# Altium schematic sheet GSR.SchDoc
size A; SheetNumber: 2; SheetTotal: 3
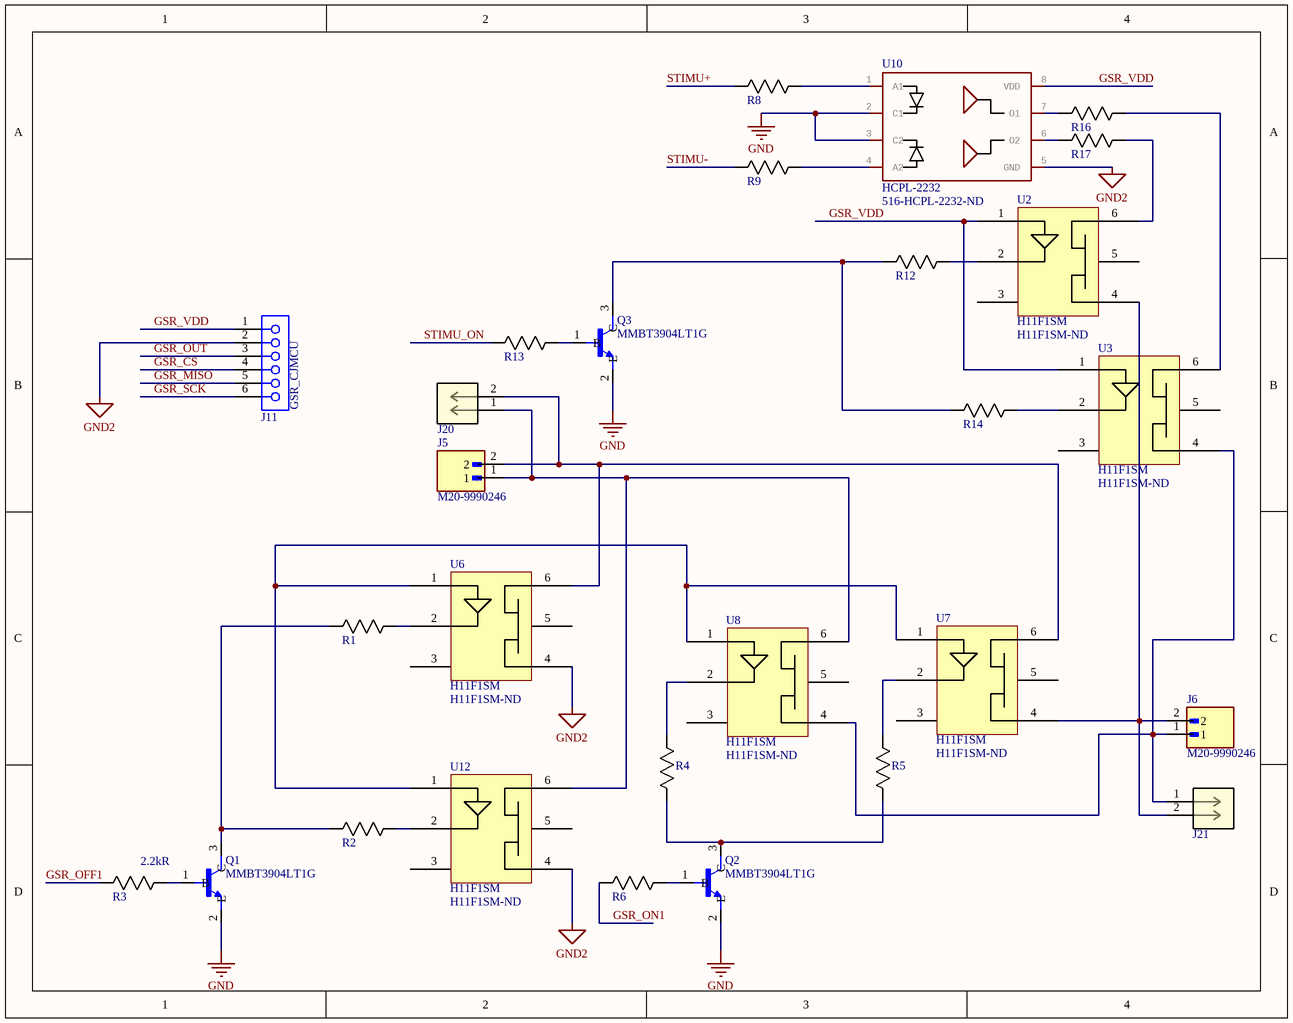
[diagram p0: GSR.SchDoc]

## Parts
J5  M20-9990246  [HARWIN_M20-9990246]
J6  M20-9990246  [HARWIN_M20-9990246]
J11  61300611821  [HEADER_SOCKET_6]  (value not drawn)
J20  B2P-VH  [CONN_B2P-VH_JST]  (value not drawn)
J21  B2P-VH  [CONN_B2P-VH_JST]  (value not drawn)
Q1  MMBT3904LT1G  [SOT95P240X111-3N]
Q2  MMBT3904LT1G  [SOT95P240X111-3N]
Q3  MMBT3904LT1G  [SOT95P240X111-3N]
R1  RMCF1206FT220R  [STA_RMCF1206_STP-L]  (value not drawn)
R2  RMCF1206FT220R  [STA_RMCF1206_STP-L]  (value not drawn)
R3  Resistance: 2.2kR  [STA_RMCF1206_STP-L]  (hidden comment: CRGCQ1206F2K2)
R4  RMCF1206FT220R  [STA_RMCF1206_STP-L]  (value not drawn)
R5  RMCF1206FT220R  [STA_RMCF1206_STP-L]  (value not drawn)
R6  CRGCQ1206F2K2  [STA_RMCF1206_STP-L]  (value not drawn)
R8  RMCF1206FT220R  [STA_RMCF1206_STP-L]  (value not drawn)
R9  RMCF1206FT220R  [STA_RMCF1206_STP-L]  (value not drawn)
R12  RMCF1206FT220R  [STA_RMCF1206_STP-L]  (value not drawn)
R13  CRGCQ1206F2K2  [STA_RMCF1206_STP-L]  (value not drawn)
R14  RMCF1206FT220R  [STA_RMCF1206_STP-L]  (value not drawn)
R16  CRGCQ1206F2K2  [STA_RMCF1206_STP-L]  (value not drawn)
R17  CRGCQ1206F2K2  [STA_RMCF1206_STP-L]  (value not drawn)
U2  H11F1SM  Supplier Part Number 1: H11F1SM-ND  [OPTOCOUPLER_H11F3SR2M]
U3  H11F1SM  Supplier Part Number 1: H11F1SM-ND  [OPTOCOUPLER_H11F3SR2M]
U6  H11F1SM  Supplier Part Number 1: H11F1SM-ND  [OPTOCOUPLER_H11F3SR2M]
U7  H11F1SM  Supplier Part Number 1: H11F1SM-ND  [OPTOCOUPLER_H11F3SR2M]
U8  H11F1SM  Supplier Part Number 1: H11F1SM-ND  [OPTOCOUPLER_H11F3SR2M]
U10  HCPL-2232  Supplier Part Number 1: 516-HCPL-2232-ND  [DIL08]
U12  H11F1SM  Supplier Part Number 1: H11F1SM-ND  [OPTOCOUPLER_H11F3SR2M]

## Nets
GND: Q1.2(E) Q2.2(E) Q3.2(E) U10.2(C1) U10.3(C2)
GND2: J11.2 U6.4 U10.5(GND) U12.4
GSR_CS: J11.4
GSR_MISO: J11.5
GSR_OFF1: R3.1
GSR_ON1: R6.1
GSR_OUT: J11.3
GSR_SCK: J11.6
GSR_VDD: J11.1 U2.1 U3.1 U10.8(VDD)
STIMU+: R8.1
STIMU-: R9.1
STIMU_ON: R13.1
NetJ5_1: J5.1 J20.1 U8.6 U12.6
NetJ5_2: J5.2 J20.2 U6.6 U7.6
NetJ6_1: J6.1 J21.1 U3.4 U8.4
NetJ6_2: J6.2 J21.2 U2.4 U7.4
NetQ1_1: Q1.1(B) R3.2
NetQ1_3: Q1.3(C) R1.1 R2.1
NetQ2_1: Q2.1(B) R6.2
NetQ2_3: Q2.3(C) R4.1 R5.1
NetQ3_1: Q3.1(B) R13.2
NetQ3_3: Q3.3(C) R12.2 R14.2
NetR1_2: R1.2 U6.2
NetR2_2: R2.2 U12.2
NetR4_2: R4.2 U8.2
NetR5_2: R5.2 U7.2
NetR8_2: R8.2 U10.1(A1)
NetR9_2: R9.2 U10.4(A2)
NetR12_1: R12.1 U2.2
NetR14_1: R14.1 U3.2
NetR16_1: R16.1 U10.7(O1)
NetR16_2: R16.2 U3.6
NetR17_1: R17.1 U10.6(O2)
NetR17_2: R17.2 U2.6
NetU6_1: U6.1 U7.1 U8.1 U12.1

Not connected (* = marked no-connect by the designer): U2 3 5; U3 3 5; U6 3 5; U7 3 5; U8 3 5; U12 3 5

## Notes on the sheet
- (near J11) GSR_CJMCU

## Library data of the parts
J5 J6 = M20-9990246: 2.54mm (0.1) Pitch SIL Vertical Throughboard Pin Header, 6.1mm mating pin height, tin, 2 contacts; MF: Harwin; SnapEDA_Link: https://www.snapeda.com/parts/M20-9990246/Harwin/view-part/?ref=snap; Package: None; Value: *; MP: M20-9990246; Check_prices: https://www.snapeda.com/parts/M20-9990246/Harwin/view-part/?ref=eda; Supplier Part Number 1: 952-2262-ND
J11 = HEADER_SOCKET_6: WR-PHD Socket Header, THT, Vertical, pitch 2.54mm, 1 Row, 6P; Manufacturer: Wurth Elektronik; Contact Resistance: 20mOhm; Rated Current: 3A; Working Voltage: 250V; Withstanding Voltage: 500V; Manufacturer Part Number: 61300611821; Category: Board-to-Board Connectors; Match Code: WR-PHD; ComponentLink1Description: Website Link; ComponentLink1URL: https://www.we-online.com/redexpert/article/61300611821?ad; ComponentLink2Description: Datasheet Link; ComponentLink2URL: https://www.we-online.com/redexpert/spec/61300611821?ad; Mount: Through Hole; Operating Temperature Max: 125°C; Operating Temperature Min: -40°C; Packaging: Tray; Gender: Socket Header; Number of Pins: 6; Number of Rows: 1; Orientation: Vertical; Pitch: 2.54mm; Supplier Part Number 1: 732-61300611821-ND
J20 J21 = B2P-VH: VH Non-RoHS Compliant 2003 Vertical Connector Header -25C~85C 10A 250V 0.303 7.70mm; Manufacturer: JST; Number of Positions: 2; Gender: Male; Pitch: 0.156inch; Supplier 1: Digikey; Manufacturer Part Number: B2P-VH; RoHS: Yes; Category: Headers and Wire Housings; Stock 1: 15152; Pricing 1: 1=0.13, 10=0.112, 100=0.0949, 500=0.08472, 1000=0.08068, 5000=0.07201, 10000=0.06857 (USD); Mount: Through Hole; Contact Plating: Tin,Lead; Housing Color: Natural; Contact Material: Brass; Housing Material: Nylon; Color: Natural; Fastening Type: Friction; Packaging: Bulk; Number of Rows: 1; Termination: Solder; Orientation: Vertical; Number of Contacts: 2; Series: VH; Contact Type: Male Pin; Package Quantity: 1000; Contact Mating Length: 0.303inch; Lead Free: Contains Lead; ComponentLink1URL: https://datasheet.ciiva.com/6892/vhseries-6892089.pdf?src-supplier=Digikey; ComponentLink1Description: https://datasheet.ciiva.com/6892/vhseries-6892089.pdf?src-supplier=Digikey; Supplier Part Number 1: 455-1639-ND
Q1-Q3 = MMBT3904LT1G: Transistor, Bipolar,Si,NPN,General Purpose,VCEO 40VDC,IC 200mA,PD 225mW,SOT-23 | ON Semiconductor MMBT3904LT1G; SnapEDA_Link: https://www.snapeda.com/parts/MMBT3904LT1G/Onsemi/view-part/?ref=snap; Package: SOT-23-3 ON Semiconductor; Value: *; MF: ON Semiconductor; MP: MMBT3904LT1G; Check_prices: https://www.snapeda.com/parts/MMBT3904LT1G/Onsemi/view-part/?ref=eda
R1 R2 R4 R5 R8 R9 R12 R14 = RMCF1206FT220R: No Description Available; Manufacturer_Name: Stackpole International; Copyright: Copyright (C) 2025 Ultra Librarian. All rights reserved.; Manufacturer_Part_Number: RMCF1206FT220R; Supplier Part Number 1: RMCF1206FT220RTR-ND
R3 = R1206F2K2: SMD Chip Resistor, 2.2 kOhm, ± 1%, 250 mW, 1206 [3216 Metric], Thick Film, General Purpose; Manufacturer: TE Connectivity; Power Rating: 250mW; Temperature Coefficient: 100ppm/°C; Voltage Rating: 200V; Supplier 1: Digikey; Manufacturer Part Number: CRGCQ1206F2K2; RoHS: Yes; Category: Chip SMD Resistors; Stock 1: 205224; Pricing 1: 1=0.1, 10=0.046, 100=0.0242, 1000=0.01451, 2500=0.01234 (USD); Case/Package: 1206; Min Operating Temperature: -55°C; Max Operating Temperature: 155°C; Packaging: Cut Tape; Voltage Rating (DC): 200V; Operating Supply Voltage: 200V; Height: 650um; RoHS Compliant: Yes; ComponentLink1URL: https://www.te.com/commerce/DocumentDelivery/DDEController?Action=srchrtrv&DocNm=1773204-3&DocType=DS&DocLang=English&src-supplier=Digikey; ComponentLink1Description: https://www.te.com/commerce/DocumentDelivery/DDEController?Action=srchrtrv&DocNm=1773204-3&DocType=DS&DocLang=English&src-supplier=Digikey; ComponentLink2URL: https://www.te.com/commerce/DocumentDelivery/DDEController?Action=srchrtrv&amp;DocNm=1773204-3&amp;DocType=DS&amp;DocLang=English&src-supplier=Digikey; ComponentLink2Description: https://www.te.com/commerce/DocumentDelivery/DDEController?Action=srchrtrv&amp;DocNm=1773204-3&amp;DocType=DS&amp;DocLang=English&src-supplier=Digikey; ComponentLink3URL: https://datasheet.octopart.com/CRGCQ1206F2K2-TE-Connectivity-datasheet-114679081.pdf?src-supplier=Master+Electronics; ComponentLink3Description: https://datasheet.octopart.com/CRGCQ1206F2K2-TE-Connectivity-datasheet-114679081.pdf?src-supplier=Master+Electronics; Supplier Part Number 1: A129814CT-ND
R6 R13 R16 R17 = R1206F2K2: SMD Chip Resistor, 2.2 kOhm, ± 1%, 250 mW, 1206 [3216 Metric], Thick Film, General Purpose; Manufacturer: TE Connectivity; Power Rating: 250mW; Resistance: 2.2kR; Temperature Coefficient: 100ppm/°C; Voltage Rating: 200V; Supplier 1: Digikey; Manufacturer Part Number: CRGCQ1206F2K2; RoHS: Yes; Category: Chip SMD Resistors; Stock 1: 205224; Pricing 1: 1=0.1, 10=0.046, 100=0.0242, 1000=0.01451, 2500=0.01234 (USD); Case/Package: 1206; Min Operating Temperature: -55°C; Max Operating Temperature: 155°C; Packaging: Cut Tape; Voltage Rating (DC): 200V; Operating Supply Voltage: 200V; Height: 650um; RoHS Compliant: Yes; ComponentLink1URL: https://www.te.com/commerce/DocumentDelivery/DDEController?Action=srchrtrv&DocNm=1773204-3&DocType=DS&DocLang=English&src-supplier=Digikey; ComponentLink1Description: https://www.te.com/commerce/DocumentDelivery/DDEController?Action=srchrtrv&DocNm=1773204-3&DocType=DS&DocLang=English&src-supplier=Digikey; ComponentLink2URL: https://www.te.com/commerce/DocumentDelivery/DDEController?Action=srchrtrv&amp;DocNm=1773204-3&amp;DocType=DS&amp;DocLang=English&src-supplier=Digikey; ComponentLink2Description: https://www.te.com/commerce/DocumentDelivery/DDEController?Action=srchrtrv&amp;DocNm=1773204-3&amp;DocType=DS&amp;DocLang=English&src-supplier=Digikey; ComponentLink3URL: https://datasheet.octopart.com/CRGCQ1206F2K2-TE-Connectivity-datasheet-114679081.pdf?src-supplier=Master+Electronics; ComponentLink3Description: https://datasheet.octopart.com/CRGCQ1206F2K2-TE-Connectivity-datasheet-114679081.pdf?src-supplier=Master+Electronics; Supplier Part Number 1: A129814CT-ND
U2 U3 U6-U8 U12 = H11F1SM: Optocoupler DC-IN 1-CH Transistor DC-OUT 6-Pin PDIP SMD White Bulk; Manufacturer: onsemi; Max Power Dissipation: 300mW; Reverse Breakdown Voltage: 5V; Forward Voltage: 1.75V; Forward Current: 60mA; Number of Channels: 1; Max Output Voltage: 30V; Isolation Voltage: 5.25kV; Input Type: DC; Isolation Voltage-Max: 5.3kV; Turn-Off Delay Time: 45us; Supplier 1: Digikey; Manufacturer Part Number: H11F1SM; RoHS: Yes; Category: Optocouplers; Stock 1: 1561; Pricing 1: 1=1.49, 50=0.8592, 100=0.7943, 500=0.67846, 1000=0.6406, 2000=0.60852, 5000=0.57351, 10000=0.55172 (USD); Mount: Surface Mount; Case/Package: SMD/SMT; Number of Pins: 6; Weight: 0.81g; Min Operating Temperature: -40°C; Max Operating Temperature: 100°C; Packaging: Bulk; Package Quantity: 1000; Reverse Voltage (DC): 5V; Max Input Current: 60mA; Number of Elements: 1; Power Dissipation: 300mW; Min Breakdown Voltage: 30V; Series: -; Reverse Voltage: 5V; Turn-On Delay Time: 45us; Length: 8.89mm; Width: 6.6mm; Height: 3.53mm; Radiation Hardening: No; Lead Free: Lead Free; RoHS Compliant: Yes; ComponentLink1URL: https://datasheet.ciiva.com/11772/0900766b80b4f817-11772282.pdf?src-supplier=Rs; ComponentLink1Description: https://datasheet.ciiva.com/11772/0900766b80b4f817-11772282.pdf?src-supplier=Rs; ComponentLink2URL: https://datasheet.ciiva.com/15118/getdatasheetpartid-172469-15118870.pdf?src-supplier=Verical; ComponentLink2Description: https://datasheet.ciiva.com/15118/getdatasheetpartid-172469-15118870.pdf?src-supplier=Verical
U10 = HCPL-2232: Optocoupler Logic Output Totem-Pole DC Input 2 Channel 8-Pin Plastic Dip Tube; Manufacturer: Broadcom Avago; Rise Time: 30ns; Number of Channels: 2; Output Current per Channel: 25mA; Isolation Voltage: 3.75kV; Data Rate: 5Mbps; Max Power Dissipation: 294mW; Propagation Delay: 300ns; Direction: Unidirectional; Forward Current: 10mA; Forward Voltage: 1.7V; Reverse Breakdown Voltage: 5V; Fall Time: 0.007us; Output Type: TOTEM POLE; Input Current: 1.8mA; Polarity: Non-Inverting; Supplier 1: Digikey; Manufacturer Part Number: HCPL-2232; RoHS: No; Category: Optocouplers; Stock 1: 448; Pricing 1: 1=14.3, 50=9.7886, 100=9.3402, 500=8.54718, 1000=8.29007 (USD); Mount: Through Hole; Case/Package: DIP; Number of Pins: 8; Min Operating Temperature: -40°C; Max Operating Temperature: 85°C; Packaging: Rail/Tube; Output Current: 25mA; Package Quantity: 50; Turn-On Delay Time: 300ns; Number of Elements: 2; Power Dissipation: 294mW; Series: -; Input Type: DC; Max Output Current: 25mA; Length: 9.65mm; Width: 6.35mm; Height: 3.56mm; Radiation Hardening: No; Lead Free: Contains Lead; RoHS Compliant: No; Reach SVHC Compliant: No; ComponentLink1URL: https://datasheet.ciiva.com/15119/getdatasheetpartid-112638-15119660.pdf?src-supplier=Verical; ComponentLink1Description: https://datasheet.ciiva.com/15119/getdatasheetpartid-112638-15119660.pdf?src-supplier=Verical; ComponentLink2URL: https://datasheet.ciiva.com/8065/310763-8065655.pdf?src-supplier=Element14; ComponentLink2Description: https://datasheet.ciiva.com/8065/310763-8065655.pdf?src-supplier=Element14